# EAGLE design schem (EAGLE 7.4.0)
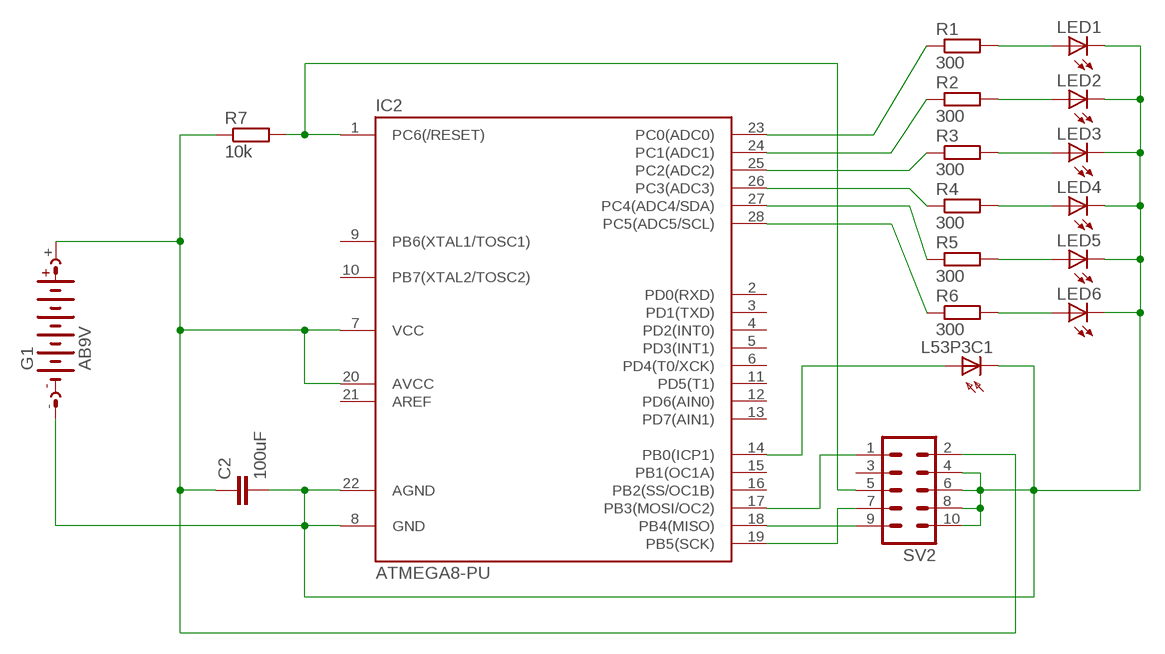
[diagram p0: schematic, sheet 1]

## Parts
C2  100uF  C-EU025-050X050  [C025-050X050]
G1  AB9V  [AB9V]
IC2  ATMEGA8-PU  [DIL28-3]
L53P3C1  BPX65  [BPX65]
LED1  LED5MM  [LED5MM]
LED2  LED5MM  [LED5MM]
LED3  LED5MM  [LED5MM]
LED4  LED5MM  [LED5MM]
LED5  LED5MM  [LED5MM]
LED6  LED5MM  [LED5MM]
R1  300  R-EU_0204/5  [0204/5]
R2  300  R-EU_0204/5  [0204/5]
R3  300  R-EU_0204/5  [0204/5]
R4  300  R-EU_0204/5  [0204/5]
R5  300  R-EU_0204/5  [0204/5]
R6  300  R-EU_0204/5  [0204/5]
R7  10k  R-EU_0204/5  [0204/5]
SV2  ML10  [ML10]

## Nets
N$17: C2.2 G1.- IC2.8(GND) IC2.22(AGND) L53P3C1.K(C) LED1.K(C) LED2.K(C) LED3.K(C) LED4.K(C) LED5.K(C) LED6.K(C) SV2.4 SV2.6 SV2.8 SV2.10
N$22: IC2.23(PC0(ADC0)) R1.1
N$23: IC2.24(PC1(ADC1)) R2.1
N$24: IC2.25(PC2(ADC2)) R3.1
N$25: IC2.27(PC4(ADC4/SDA)) R5.1
N$26: IC2.28(PC5(ADC5/SCL)) R6.1
N$27: LED3.A R3.2
N$28: LED6.A R6.2
N$29: IC2.17(PB3(MOSI/OC2)) SV2.1
N$30: IC2.18(PB4(MISO)) SV2.9
N$31: IC2.19(PB5(SCK)) SV2.7
N$32: IC2.1(PC6(/RESET)) R7.2 SV2.5
N$33: IC2.14(PB0(ICP1)) L53P3C1.A
N$34: IC2.26(PC3(ADC3)) R4.1
N$35: LED1.A R1.2
N$36: LED2.A R2.2
N$37: LED4.A R4.2
N$38: LED5.A R5.2
N$39: C2.1 G1.+ IC2.7(VCC) IC2.20(AVCC) R7.1 SV2.2
Unconnected: IC2.2(PD0(RXD)) IC2.3(PD1(TXD)) IC2.4(PD2(INT0)) IC2.5(PD3(INT1)) IC2.6(PD4(T0/XCK)) IC2.9(PB6(XTAL1/TOSC1)) IC2.10(PB7(XTAL2/TOSC2)) IC2.11(PD5(T1)) IC2.12(PD6(AIN0)) IC2.13(PD7(AIN1)) IC2.15(PB1(OC1A)) IC2.16(PB2(SS/OC1B)) IC2.21(AREF) SV2.3

## Library data of the parts
C2 = rcl:C-EU: CAPACITOR, European symbol
G1 = battery:AB9V: 9-V BATTERY CLIP
IC2 = atmega8:ATMEGA8-PU
L53P3C1 = opto-trans-siemens:BPX65: PHOTO DIODE; MPN: BPX65.; OC_FARNELL: 327451; OC_NEWARK: 06WX2764
LED1-LED6 = led:LED: LED OSRAM: - CHIPLED LG R971, LG N971, LY N971, LG Q971, LY Q971, LO R971, LY R971 LH N974, LH R974 LS Q976, LO Q976, LY Q976 LO Q996 - Hyper CHIPLED LW Q18S LB Q993, LB Q99A, LB R99A - SideLED LS A670, LO A670, LY A670, LG A670, LP A670 LB A673, LV A673, LT A673, LW A673 LH A674 LY A675 LS A676, LA A676, LO A676, LY A676, LW A676 LS A679, LY A679, LG A679 - Hyper Micro SIDELED® LS Y876, LA Y876, LO Y876, LY Y876 LT Y87S - SmartLED LW L88C, LW L88S LB L89C, LB L89S, LG L890 LS L89K, LO L89K, LY L89K LS L896, LA L896, LO L896, LY L896 - TOPLED LS T670, LO T670, LY T670, LG T670, LP T670 LSG T670, LSP T670, LSY T670, LOP T670, LYG T670 LG T671, LOG T671, LSG T671 LB T673, LV T673, LT T673, LW T673 LH T674 LS T676, LA T676, LO T676, LY T676, LB T676, LH T676, LSB T676, LW T676 LB T67C, LV T67C, LT T67C, LS T67K, LO T67K, LY T67K, LW E67C LS E67B, LA E67B, LO E67B, LY E67B, LB E67C, LV E67C, LT E67C LW T67C LS T679, LY T679, LG T679 LS T770, LO T770, LY T770, LG T770, LP T770 LB T773, LV T773, LT T773, LW T773 LH T774 LS E675, LA E675, LY E675, LS T675 LS T776, LA T776, LO T776, LY T776, LB T776 LHGB T686 LT T68C, LB T68C - Hyper Mini TOPLED® LB M676 - Mini TOPLED Santana® LG M470 LS M47K, LO M47K, LY M47K Source: http://www.osram.convergy.de LUXEON: - LUMILED® LXK2-PW12-R00, LXK2-PW12-S00, LXK2-PW14-U00, LXK2-PW14-V00 LXK2-PM12-R00, LXK2-PM12-S00, LXK2-PM14-U00 LXK2-PE12-Q00, LXK2-PE12-R00, LXK2-PE12-S00, LXK2-PE14-T00, LXK2-PE14-U00 LXK2-PB12-K00, LXK2-PB12-L00, LXK2-PB12-M00, LXK2-PB14-N00, LXK2-PB14-P00, LXK2-PB14-Q00 LXK2-PR12-L00, LXK2-PR12-M00, LXK2-PR14-Q00, LXK2-PR14-R00 LXK2-PD12-Q00, LXK2-PD12-R00, LXK2-PD12-S00 LXK2-PH12-R00, LXK2-PH12-S00 LXK2-PL12-P00, LXK2-PL12-Q00, LXK2-PL12-R00 Source: www.luxeon.com KINGBRIGHT: KA-3528ASYC Source: www.kingbright.com
R1-R7 = resistor:R-EU_: RESISTOR, European symbol
SV2 = con-harting-ml:ML10: HARTING; OC_FARNELL: unknown; OC_NEWARK: unknown

## Net classes
0 default: width 0.762 mm, drill 0.381 mm, clearance 0.381 mm

## Board
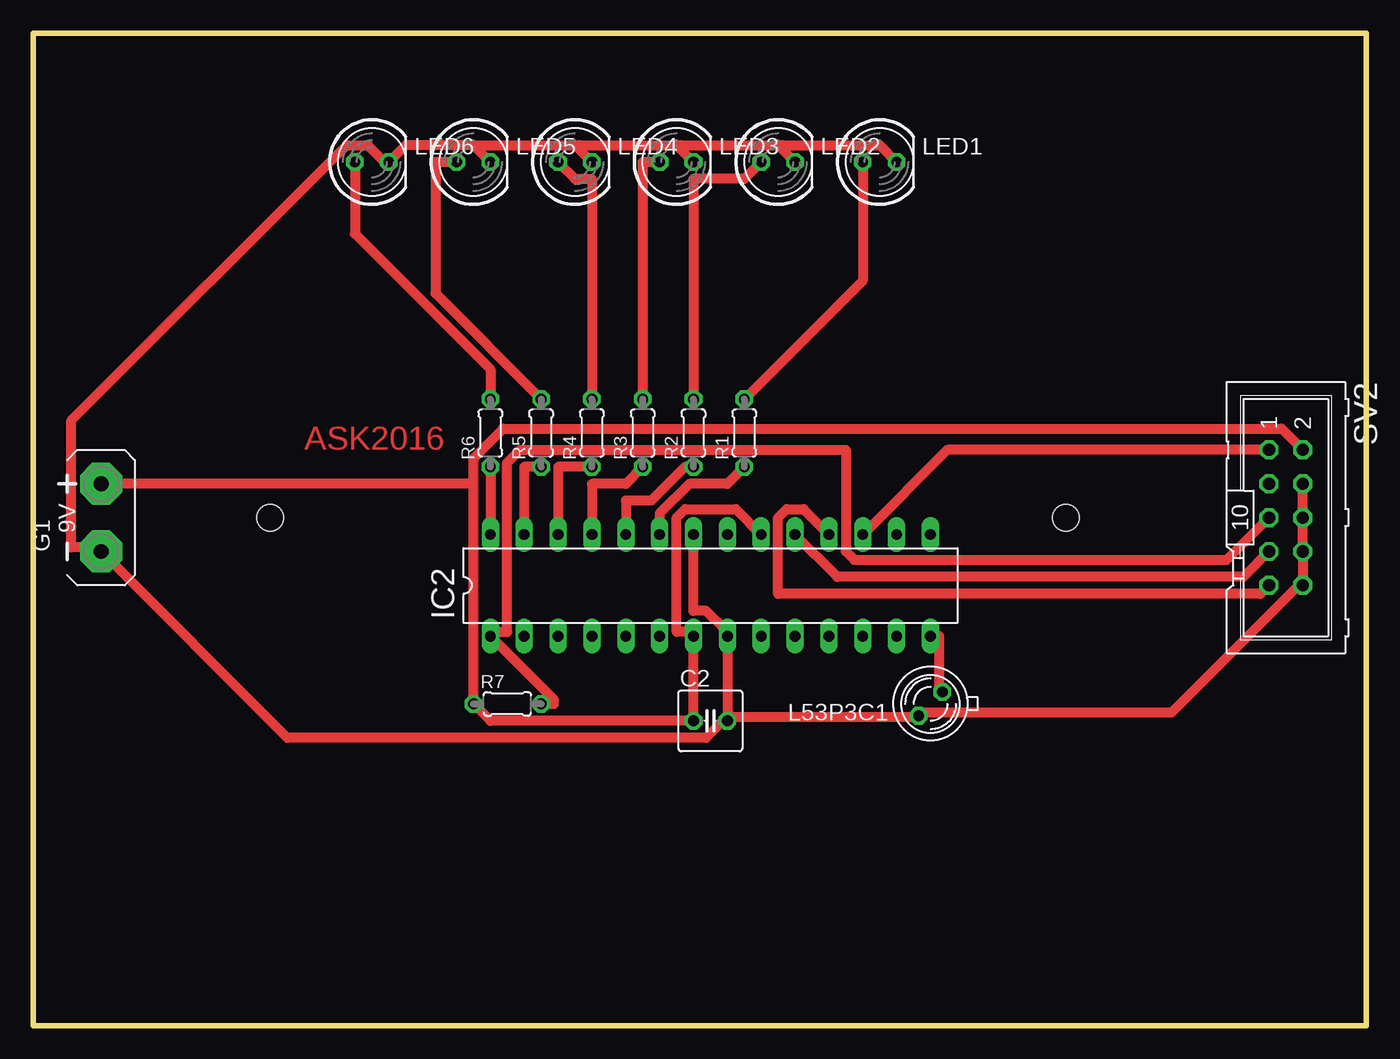
[diagram p1: board, top side]

Size 100 x 74.42 mm. Coordinates in mm from the lower left corner, seen from the top.
Outline: 0,0 100,0 100,74.42 0,74.42 0,0
Copper layers 1: Top 0.035mm
Design rules "default *": minimum track width 30mil, minimum drill 24mil, track to track 8mil, track to pad 8mil, pad to pad 8mil, via to via 8mil, smd to smd 8mil, copper to edge 40mil, drill to drill 8mil, minimum pad ring 10mil, minimum via ring 8mil, stop-mask expansion 4mil, vias tented up to drill 0mil, thermal gap 10mil
Holes 2 mm at 17.78,38.1 77.47,38.1

### Footprints (pad centres in the part's own frame; a part is rotated, then mirrored left to right if it is on the bottom)
C025-050X050 = drill 0.813 octagon: 1 -1.27,0; 2 1.27,0
AB9V = drill 1.118 pad 3.15 octagon: + 0,2.54; - 0,-2.54
DIL28-3 = drill 0.813 long: 1 -16.51,-3.81; 2 -13.97,-3.81; 3 -11.43,-3.81; 4 -8.89,-3.81; 5 -6.35,-3.81; 6 -3.81,-3.81; 7 -1.27,-3.81; 8 1.27,-3.81; 9 3.81,-3.81; 10 6.35,-3.81; 11 8.89,-3.81; 12 11.43,-3.81; 13 13.97,-3.81; 14 16.51,-3.81; 15 16.51,3.81; 16 13.97,3.81; 17 11.43,3.81; 18 8.89,3.81; 19 6.35,3.81; 20 3.81,3.81; 21 1.27,3.81; 22 -1.27,3.81; 23 -3.81,3.81; 24 -6.35,3.81; 25 -8.89,3.81; 26 -11.43,3.81; 27 -13.97,3.81; 28 -16.51,3.81
BPX65 = drill 0.813 octagon: A -0.889,-0.889; K 0.889,0.889
LED5MM = drill 0.813 octagon: A -1.27,0; K 1.27,0
0204/5 = drill 0.813 octagon: 1 -2.54,0; 2 2.54,0
ML10 = drill 0.914 octagon: 1 -5.08,-1.27; 2 -5.08,1.27; 3 -2.54,-1.27; 4 -2.54,1.27; 5 0,-1.27; 6 0,1.27; 7 2.54,-1.27; 8 2.54,1.27; 9 5.08,-1.27; 10 5.08,1.27

### Placement (x,y rotation side)
C2  50.8,22.86 0 top
G1  5.08,38.1 0 top
IC2  50.8,33.02 0 top
L53P3C1  67.31,24.13 180 top
LED1  63.5,64.77 0 top
LED2  55.88,64.77 0 top
LED3  48.26,64.77 0 top
LED4  40.64,64.77 0 top
LED5  33.02,64.77 0 top
LED6  25.4,64.77 0 top
R1  53.34,44.45 90 top
R2  49.53,44.45 90 top
R3  45.72,44.45 90 top
R4  41.91,44.45 90 top
R5  38.1,44.45 90 top
R6  34.29,44.45 90 top
R7  35.56,24.13 0 top
SV2  93.98,38.1 270 top

### Tracks (layer width: path | path; a pad name or v marks a point on that pad's centre or on a via)
N$17
  Top 0.762: 33.02,66.04 27.94,66.04 LED6.K 26.35,64.77 25.08,66.04 23.5,66.04 2.86,45.4 2.86,35.88 5.08,35.88 G1.- 19.05,21.59 50.48,21.59 51.75,22.86 C2.2 | LED5.K 33.02,66.04 | 40.8,65.88 40.64,66.04 33.02,66.04 | 40.8,65.88 LED4.K | 48.42,65.88 48.26,66.04 40.96,66.04 40.8,65.88 | 48.42,65.88 LED3.K | 56.04,65.88 55.88,66.04 48.58,66.04 48.42,65.88 | 56.04,65.88 LED2.K | LED1.K 63.5,66.04 56.2,66.04 56.04,65.88 | SV2.4 SV2.6 SV2.8 SV2.10 94.93,33.02 85.41,23.5 66.67,23.5 L53P3C1.K 66.36,23.18 52.39,23.18 C2.2 | C2.2 IC2.8 52.07,29.53 50.48,31.11 49.53,31.11 IC2.22
N$22
  Top 0.762: IC2.23 46.99,38.42 49.21,40.64 52.07,40.64 R1.1
N$23
  Top 0.762: IC2.24 44.45,39.37 46.35,39.37 48.9,41.91 R2.1
N$24
  Top 0.762: IC2.25 41.91,40.64 44.45,40.64 R3.1
N$25
  Top 0.762: IC2.27 36.83,41.91 R5.1
N$26
  Top 0.762: R6.1 IC2.28
N$27
  Top 0.762: R3.2 45.72,64.77 LED3.A
N$28
  Top 0.762: R6.2 34.29,49.21 24.13,59.37 LED6.A
N$29
  Top 0.762: IC2.17 68.58,43.18 SV2.1
N$30
  Top 0.762: IC2.18 57.78,38.73 56.52,38.73 55.88,38.1 55.88,32.38 92.08,32.38 SV2.9
N$31
  Top 0.762: IC2.19 60.33,33.66 90.81,33.66 SV2.7
N$32
  Top 0.762: R7.2 39.05,24.13 39.05,24.45 IC2.1 34.29,29.53 35.56,29.53 35.56,42.23 36.51,43.18 60.96,43.18 60.96,35.56 61.59,34.92 89.53,34.92 SV2.5
N$33
  Top 0.762: IC2.14 67.94,29.21 67.94,25.08 L53P3C1.A
N$34
  Top 0.762: IC2.26 39.37,41.91 R4.1
N$35
  Top 0.762: R1.2 62.23,55.88 LED1.A
N$36
  Top 0.762: R2.2 49.53,63.5 53.34,63.5 LED2.A
N$37
  Top 0.762: R4.2 41.91,63.5 40.64,63.5 LED4.A
N$38
  Top 0.762: R5.2 30.16,54.93 30.16,64.77 LED5.A
N$39
  Top 0.762: IC2.20 52.7,38.73 48.9,38.73 48.26,38.1 48.26,29.53 49.53,29.53 IC2.7 C2.1 34.29,22.86 R7.1 33.02,40.64 | SV2.2 93.66,44.77 35.24,44.77 33.02,42.55 33.02,40.64 | 33.02,40.64 G1.+

### Text on the board
Top: ASK2016